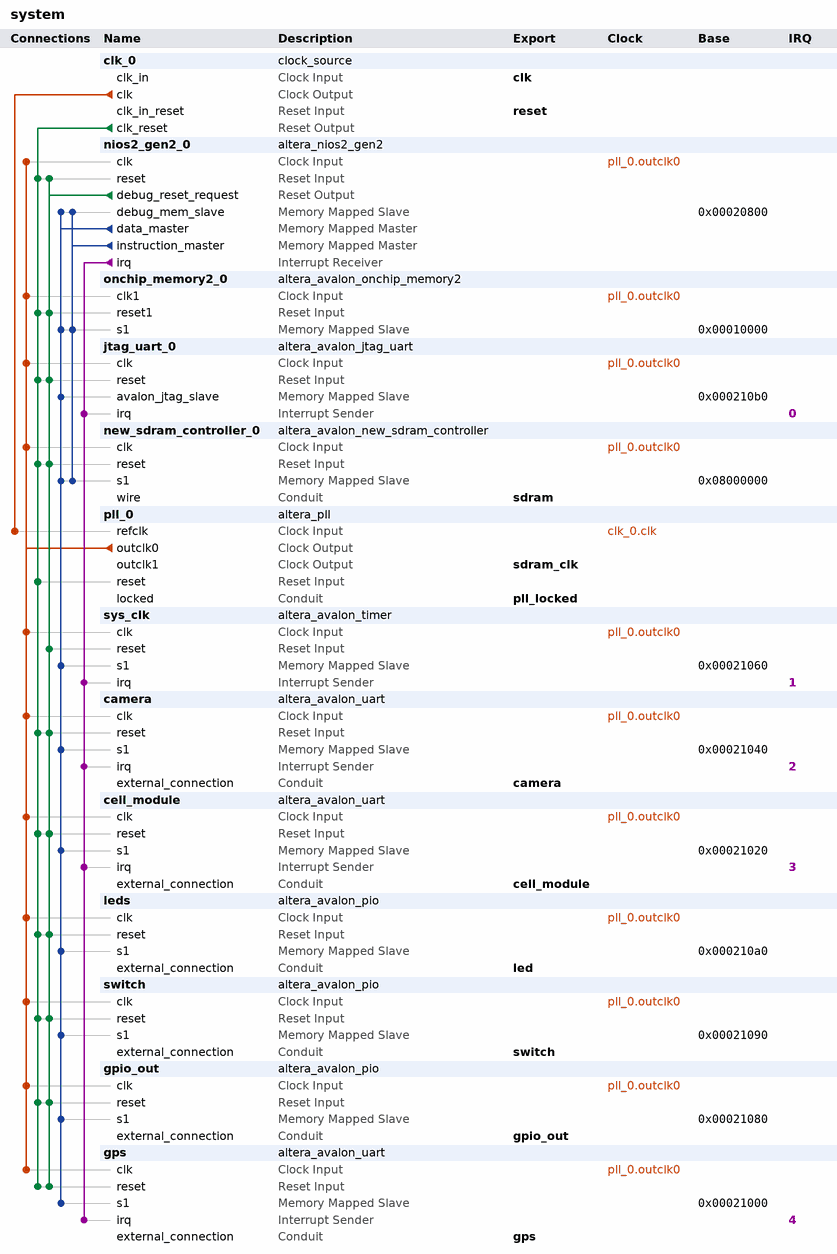
[diagram p0: system contents]
# Platform Designer (Qsys) system system, Cyclone V 5CSEMA5F31C6
# Parameters at their usual value, and those the tool derives, are not listed.
package require -exact qsys 18.1
create_system system
set_project_property DEVICE_FAMILY {Cyclone V}
set_project_property DEVICE 5CSEMA5F31C6

add_instance clk_0 clock_source 18.1
set_instance_parameter_value clk_0 clockFrequency 50000000

add_instance nios2_gen2_0 altera_nios2_gen2 18.1
set_instance_parameter_value nios2_gen2_0 dcache_size 2048
set_instance_parameter_value nios2_gen2_0 exceptionSlave onchip_memory2_0.s1
set_instance_parameter_value nios2_gen2_0 icache_size 4096
set_instance_parameter_value nios2_gen2_0 impl Tiny
set_instance_parameter_value nios2_gen2_0 resetSlave onchip_memory2_0.s1

add_instance onchip_memory2_0 altera_avalon_onchip_memory2 18.1
set_instance_parameter_value onchip_memory2_0 dataWidth 32
set_instance_parameter_value onchip_memory2_0 dualPort false
set_instance_parameter_value onchip_memory2_0 initMemContent true
set_instance_parameter_value onchip_memory2_0 initializationFileName onchip_mem.hex
set_instance_parameter_value onchip_memory2_0 memorySize 65536

add_instance jtag_uart_0 altera_avalon_jtag_uart 18.1
set_instance_parameter_value jtag_uart_0 simInteractiveOptions NO_INTERACTIVE_WINDOWS

add_instance new_sdram_controller_0 altera_avalon_new_sdram_controller 18.1
set_instance_parameter_value new_sdram_controller_0 TAC 5.4
set_instance_parameter_value new_sdram_controller_0 TRCD 15.0
set_instance_parameter_value new_sdram_controller_0 TRP 15.0
set_instance_parameter_value new_sdram_controller_0 casLatency 3
set_instance_parameter_value new_sdram_controller_0 columnWidth 10
set_instance_parameter_value new_sdram_controller_0 dataWidth 16
set_instance_parameter_value new_sdram_controller_0 generateSimulationModel true
set_instance_parameter_value new_sdram_controller_0 model single_Micron_MT48LC4M32B2_7_chip
set_instance_parameter_value new_sdram_controller_0 numberOfBanks 4
set_instance_parameter_value new_sdram_controller_0 numberOfChipSelects 1
set_instance_parameter_value new_sdram_controller_0 powerUpDelay 100.0
set_instance_parameter_value new_sdram_controller_0 refreshPeriod 7.8125
set_instance_parameter_value new_sdram_controller_0 rowWidth 13

add_instance pll_0 altera_pll 18.1
set_instance_parameter_value pll_0 gui_device_speed_grade 1
set_instance_parameter_value pll_0 gui_number_of_clocks 2
set_instance_parameter_value pll_0 gui_operation_mode direct
set_instance_parameter_value pll_0 gui_output_clock_frequency0 50.0
set_instance_parameter_value pll_0 gui_output_clock_frequency1 50.0
set_instance_parameter_value pll_0 gui_phase_shift1 -3000
set_instance_parameter_value pll_0 gui_pll_mode {Integer-N PLL}
set_instance_parameter_value pll_0 gui_reference_clock_frequency 50.0
set_instance_parameter_value pll_0 gui_use_locked true

add_instance sys_clk altera_avalon_timer 18.1
set_instance_parameter_value sys_clk period 1
set_instance_parameter_value sys_clk periodUnits MSEC

add_instance camera altera_avalon_uart 18.1
set_instance_parameter_value camera baud 38400
set_instance_parameter_value camera dataBits 8
set_instance_parameter_value camera fixedBaud false
set_instance_parameter_value camera parity NONE
set_instance_parameter_value camera stopBits 1

add_instance cell_module altera_avalon_uart 18.1
set_instance_parameter_value cell_module baud 115200
set_instance_parameter_value cell_module dataBits 8
set_instance_parameter_value cell_module fixedBaud true
set_instance_parameter_value cell_module parity NONE
set_instance_parameter_value cell_module stopBits 1

add_instance leds altera_avalon_pio 18.1
set_instance_parameter_value leds direction Output
set_instance_parameter_value leds width 8

add_instance switch altera_avalon_pio 18.1
set_instance_parameter_value switch direction Input
set_instance_parameter_value switch width 8

add_instance gpio_out altera_avalon_pio 18.1
set_instance_parameter_value gpio_out direction Output
set_instance_parameter_value gpio_out width 1

add_instance gps altera_avalon_uart 18.1
set_instance_parameter_value gps baud 115200
set_instance_parameter_value gps dataBits 8
set_instance_parameter_value gps fixedBaud true
set_instance_parameter_value gps parity NONE
set_instance_parameter_value gps stopBits 1

# connections
add_connection clk_0.clk pll_0.refclk clock
add_connection pll_0.outclk0 camera.clk clock
add_connection pll_0.outclk0 cell_module.clk clock
add_connection pll_0.outclk0 gpio_out.clk clock
add_connection pll_0.outclk0 gps.clk clock
add_connection pll_0.outclk0 jtag_uart_0.clk clock
add_connection pll_0.outclk0 leds.clk clock
add_connection pll_0.outclk0 new_sdram_controller_0.clk clock
add_connection pll_0.outclk0 nios2_gen2_0.clk clock
add_connection pll_0.outclk0 onchip_memory2_0.clk1 clock
add_connection pll_0.outclk0 switch.clk clock
add_connection pll_0.outclk0 sys_clk.clk clock
add_connection clk_0.clk_reset camera.reset reset
add_connection clk_0.clk_reset cell_module.reset reset
add_connection clk_0.clk_reset gpio_out.reset reset
add_connection clk_0.clk_reset gps.reset reset
add_connection clk_0.clk_reset jtag_uart_0.reset reset
add_connection clk_0.clk_reset leds.reset reset
add_connection clk_0.clk_reset new_sdram_controller_0.reset reset
add_connection clk_0.clk_reset nios2_gen2_0.reset reset
add_connection clk_0.clk_reset onchip_memory2_0.reset1 reset
add_connection clk_0.clk_reset pll_0.reset reset
add_connection clk_0.clk_reset switch.reset reset
add_connection nios2_gen2_0.debug_reset_request camera.reset reset
add_connection nios2_gen2_0.debug_reset_request cell_module.reset reset
add_connection nios2_gen2_0.debug_reset_request gpio_out.reset reset
add_connection nios2_gen2_0.debug_reset_request gps.reset reset
add_connection nios2_gen2_0.debug_reset_request jtag_uart_0.reset reset
add_connection nios2_gen2_0.debug_reset_request leds.reset reset
add_connection nios2_gen2_0.debug_reset_request new_sdram_controller_0.reset reset
add_connection nios2_gen2_0.debug_reset_request nios2_gen2_0.reset reset
add_connection nios2_gen2_0.debug_reset_request onchip_memory2_0.reset1 reset
add_connection nios2_gen2_0.debug_reset_request switch.reset reset
add_connection nios2_gen2_0.debug_reset_request sys_clk.reset reset
add_connection nios2_gen2_0.data_master camera.s1 avalon
set_connection_parameter_value nios2_gen2_0.data_master/camera.s1 baseAddress 0x00021040
add_connection nios2_gen2_0.data_master cell_module.s1 avalon
set_connection_parameter_value nios2_gen2_0.data_master/cell_module.s1 baseAddress 0x00021020
add_connection nios2_gen2_0.data_master gpio_out.s1 avalon
set_connection_parameter_value nios2_gen2_0.data_master/gpio_out.s1 baseAddress 0x00021080
add_connection nios2_gen2_0.data_master gps.s1 avalon
set_connection_parameter_value nios2_gen2_0.data_master/gps.s1 baseAddress 0x00021000
add_connection nios2_gen2_0.data_master jtag_uart_0.avalon_jtag_slave avalon
set_connection_parameter_value nios2_gen2_0.data_master/jtag_uart_0.avalon_jtag_slave baseAddress 0x000210b0
add_connection nios2_gen2_0.data_master leds.s1 avalon
set_connection_parameter_value nios2_gen2_0.data_master/leds.s1 baseAddress 0x000210a0
add_connection nios2_gen2_0.data_master new_sdram_controller_0.s1 avalon
set_connection_parameter_value nios2_gen2_0.data_master/new_sdram_controller_0.s1 baseAddress 0x08000000
add_connection nios2_gen2_0.data_master nios2_gen2_0.debug_mem_slave avalon
set_connection_parameter_value nios2_gen2_0.data_master/nios2_gen2_0.debug_mem_slave baseAddress 0x00020800
add_connection nios2_gen2_0.data_master onchip_memory2_0.s1 avalon
set_connection_parameter_value nios2_gen2_0.data_master/onchip_memory2_0.s1 baseAddress 0x00010000
add_connection nios2_gen2_0.data_master switch.s1 avalon
set_connection_parameter_value nios2_gen2_0.data_master/switch.s1 baseAddress 0x00021090
add_connection nios2_gen2_0.data_master sys_clk.s1 avalon
set_connection_parameter_value nios2_gen2_0.data_master/sys_clk.s1 baseAddress 0x00021060
add_connection nios2_gen2_0.instruction_master new_sdram_controller_0.s1 avalon
set_connection_parameter_value nios2_gen2_0.instruction_master/new_sdram_controller_0.s1 baseAddress 0x08000000
add_connection nios2_gen2_0.instruction_master nios2_gen2_0.debug_mem_slave avalon
set_connection_parameter_value nios2_gen2_0.instruction_master/nios2_gen2_0.debug_mem_slave baseAddress 0x00020800
add_connection nios2_gen2_0.instruction_master onchip_memory2_0.s1 avalon
set_connection_parameter_value nios2_gen2_0.instruction_master/onchip_memory2_0.s1 baseAddress 0x00010000
add_connection nios2_gen2_0.irq camera.irq interrupt
set_connection_parameter_value nios2_gen2_0.irq/camera.irq irqNumber 2
add_connection nios2_gen2_0.irq cell_module.irq interrupt
set_connection_parameter_value nios2_gen2_0.irq/cell_module.irq irqNumber 3
add_connection nios2_gen2_0.irq gps.irq interrupt
set_connection_parameter_value nios2_gen2_0.irq/gps.irq irqNumber 4
add_connection nios2_gen2_0.irq jtag_uart_0.irq interrupt
set_connection_parameter_value nios2_gen2_0.irq/jtag_uart_0.irq irqNumber 0
add_connection nios2_gen2_0.irq sys_clk.irq interrupt
set_connection_parameter_value nios2_gen2_0.irq/sys_clk.irq irqNumber 1

# exported interfaces
add_interface camera conduit end
set_interface_property camera EXPORT_OF camera.external_connection
add_interface cell_module conduit end
set_interface_property cell_module EXPORT_OF cell_module.external_connection
add_interface clk clock sink
set_interface_property clk EXPORT_OF clk_0.clk_in
add_interface gpio_out conduit end
set_interface_property gpio_out EXPORT_OF gpio_out.external_connection
add_interface gps conduit end
set_interface_property gps EXPORT_OF gps.external_connection
add_interface led conduit end
set_interface_property led EXPORT_OF leds.external_connection
add_interface pll_locked conduit end
set_interface_property pll_locked EXPORT_OF pll_0.locked
add_interface reset reset sink
set_interface_property reset EXPORT_OF clk_0.clk_in_reset
add_interface sdram conduit end
set_interface_property sdram EXPORT_OF new_sdram_controller_0.wire
add_interface sdram_clk clock source
set_interface_property sdram_clk EXPORT_OF pll_0.outclk1
add_interface switch conduit end
set_interface_property switch EXPORT_OF switch.external_connection

set_interconnect_requirement {$system} qsys_mm.clockCrossingAdapter HANDSHAKE
set_interconnect_requirement {$system} qsys_mm.enableEccProtection FALSE
set_interconnect_requirement {$system} qsys_mm.insertDefaultSlave FALSE
set_interconnect_requirement {$system} qsys_mm.maxAdditionalLatency 1

save_system system.qsys
